# EAGLE design T03-GSM-Schematic (EAGLE 7.6.0)
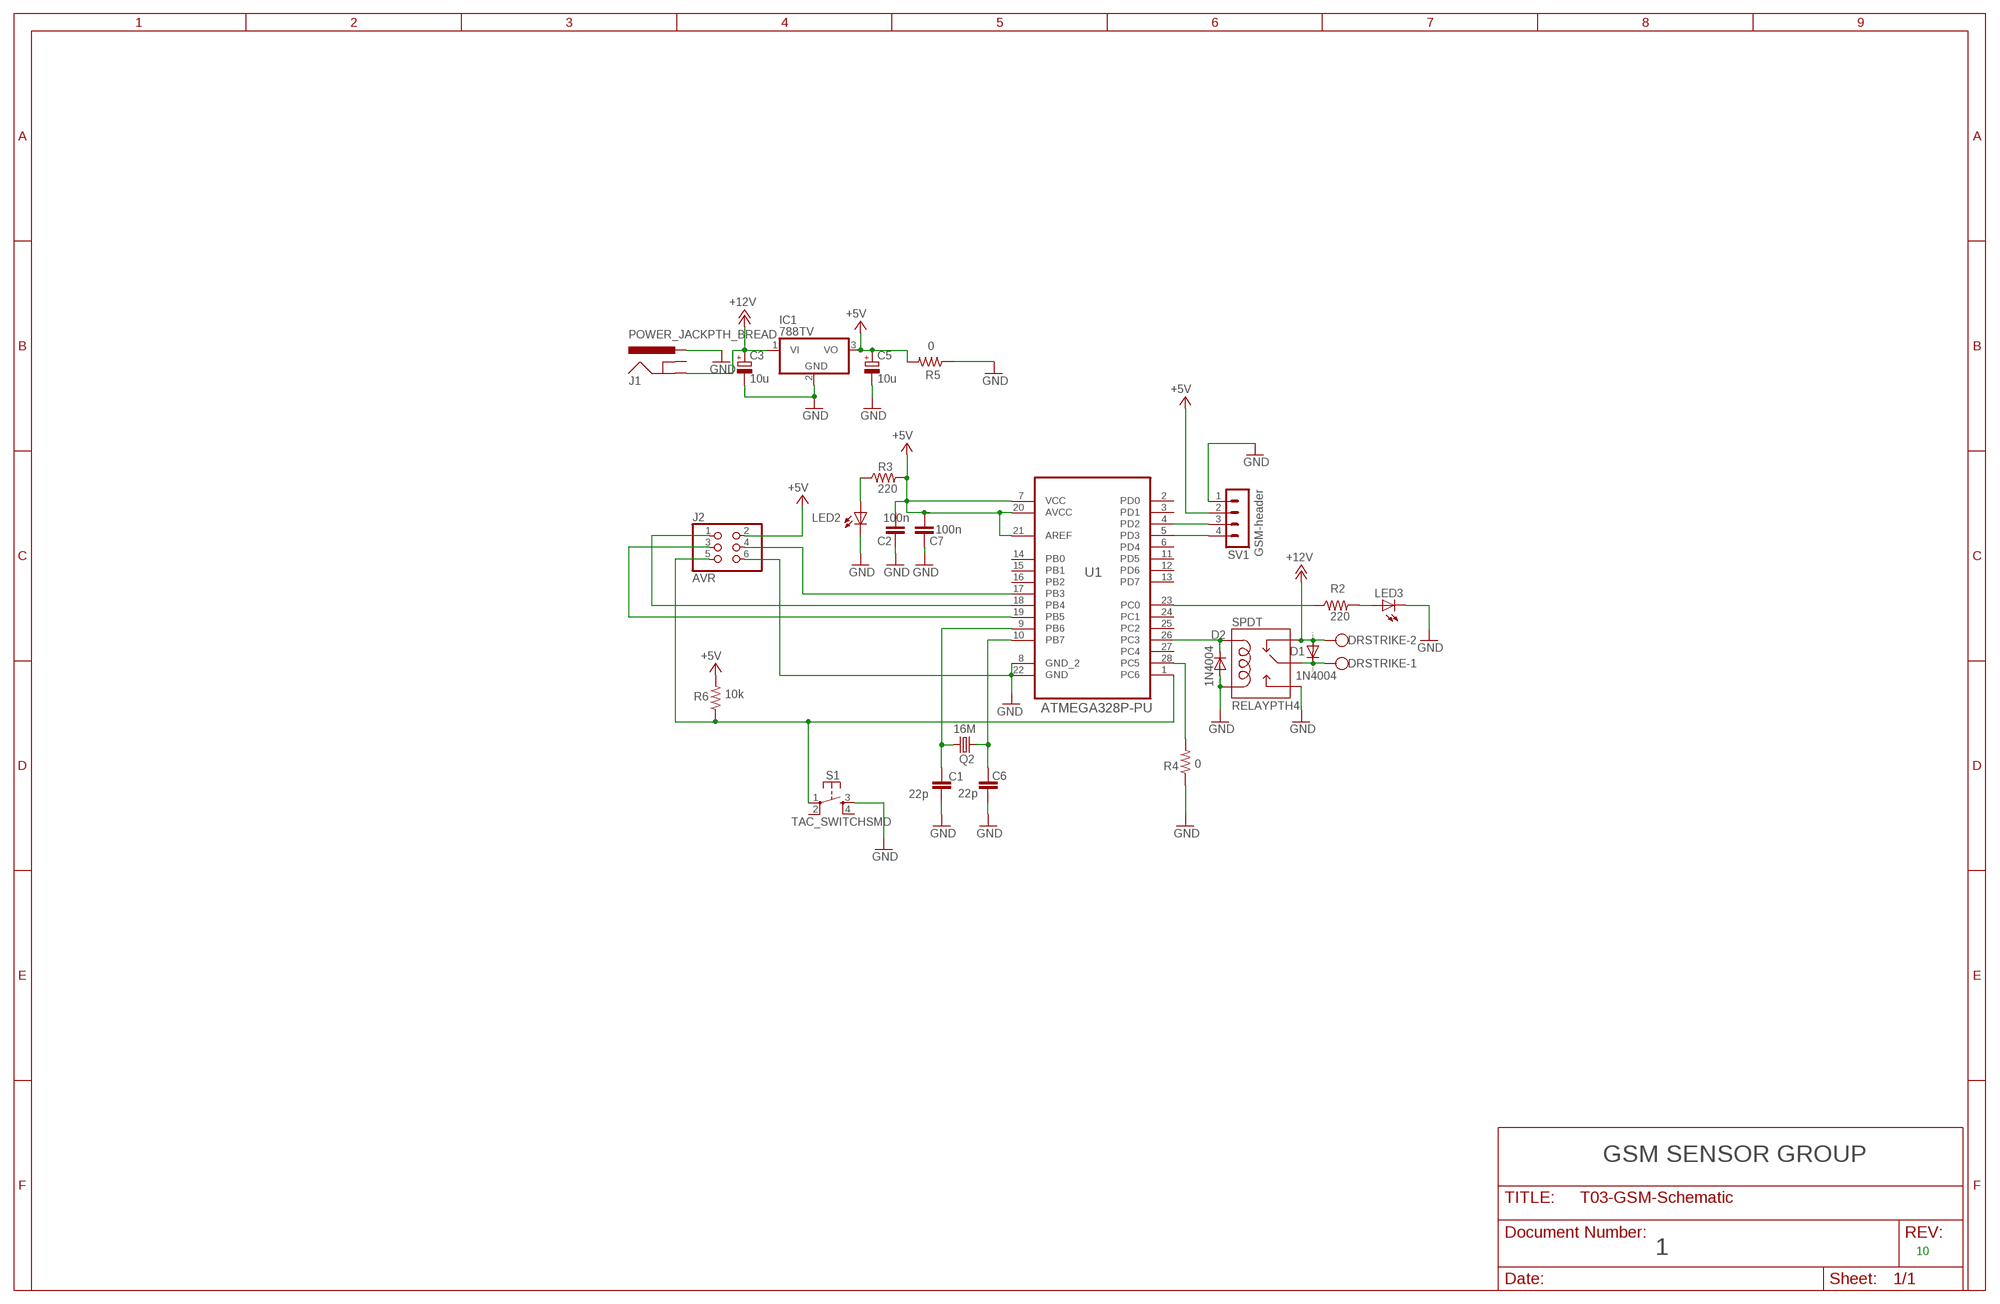
[diagram p0: schematic, sheet 1]

## Parts
C1  22p  C-EUC0603  [C0603]
C2  100n  C-EUC0603  [C0603]
C3  10u  CPOL-EUE5-10.5  [E5-10,5]
C5  10u  CPOL-EUE5-10.5  [E5-10,5]
C6  22p  C-EUC0603  [C0603]
C7  100n  C-EUC0603  [C0603]
D1  1N4004  [DO41-10]
D2  1N4004  [DO41-10]
DRSTRIKE  W237-102  [W237-102]
IC1  788TV  [TO220V]
J1  POWER_JACKPTH_BREAD  [POWER_JACK_PTH_BREAD]
J2  AVR  PINHD-2X3  [2X03]
LED2  LEDSML0603  [SML0603]
LED3  LED5MM  [LED5MM]
Q2  16M  CRYSTALHC49UP  [HC49UP]
R2  220  R-US_R0603  [R0603]
R3  220  R-US_R0603  [R0603]
R4  0  R-US_0204/5  [0204/5]
R5  0  R-US_0204/5  [0204/5]
R6  10k  R-US_R0603  [R0603]
S1  TAC_SWITCHSMD  [TACTILE-SWITCH-SMD]
SPDT  RELAYPTH4  [RELAY-JZC]
SV1  GSM-header  MA04-1  [MA04-1]
U1  ATMEGA328P-PU  [DIP254P762X457-28]

## Nets
+5V: C2.2 C5.+ C7.2 IC1.3(VO) J2.2 R3.2 R5.2 R6.2 SV1.2 U1.7(VCC) U1.20(AVCC) U1.21(AREF)
+12V: C3.+ D1.A DRSTRIKE.2 IC1.1(VI) J1.GND SPDT.2(NC)
GND: C1.2 C2.1 C3.- C5.- C6.2 C7.1 D2.A IC1.2(GND) J1.PWR J2.6 LED2.C LED3.K(C) R4.1 R5.1 S1.3 SPDT.1(COIL2) SPDT.3(NO) SV1.1 U1.8(GND_2) U1.22(GND)
N$2: J2.5 R6.1 S1.1 U1.1(PC6)
N$3: LED2.A R3.1
N$4: D1.C DRSTRIKE.1 SPDT.4(MAIN)
N$5: J2.3 U1.19(PB5)
N$6: LED3.A R2.2
N$7: J2.4 U1.17(PB3)
N$8: J2.1 U1.18(PB4)
N$9: R2.1 U1.23(PC0)
N$12: R4.2 U1.28(PC5)
N$14: D2.C SPDT.5(COIL1) U1.26(PC3)
N$16: C1.1 Q2.2 U1.9(PB6)
N$18: C6.1 Q2.1 U1.10(PB7)
RX: SV1.4 U1.5(PD3)
TX: SV1.3 U1.4(PD2)
Unconnected: J1.GNDBREAK S1.2 S1.4 U1.2(PD0) U1.3(PD1) U1.6(PD4) U1.11(PD5) U1.12(PD6) U1.13(PD7) U1.14(PB0) U1.15(PB1) U1.16(PB2) U1.24(PC1) U1.25(PC2) U1.27(PC4)

## Notes on the sheet
- GSM SENSOR GROUP
- 1 | 10

## Library data of the parts
C1 C2 C6 C7 = rcl:C-EU: CAPACITOR, European symbol
C3 C5 = rcl:CPOL-EU: POLARIZED CAPACITOR, European symbol
D1 D2 = diode:1N4004: DIODE general purpose rectifier, 1 A
DRSTRIKE = con-wago-500:W237-102: WAGO SCREW CLAMP; MPN: 237-102; OC_FARNELL: unknown; OC_NEWARK: 70K9898
IC1 = linear:78*: Positive VOLTAGE REGULATOR Source: http://cache.national.com/ds/LM/LM78L05.pdf http://www.fairchildsemi.com/ds/LM/LM7805.pdf
J1 = SparkFun-Connectors:POWER_JACK: Power Jack This is the standard 5.5mm barrel jack for power. The PTH is the most common, proven, reliable, footprint. The Slot footprint only works if the mill layer is transmitted to the PCB fab house so be warned. Mating wall wart : TOL-00298 (and others); PROD_ID: PRT-10811
J2 = pinhead:PINHD-2X3: PIN HEADER
LED2 LED3 = led:LED: LED OSRAM: - CHIPLED LG R971, LG N971, LY N971, LG Q971, LY Q971, LO R971, LY R971 LH N974, LH R974 LS Q976, LO Q976, LY Q976 LO Q996 - Hyper CHIPLED LW Q18S LB Q993, LB Q99A, LB R99A - SideLED LS A670, LO A670, LY A670, LG A670, LP A670 LB A673, LV A673, LT A673, LW A673 LH A674 LY A675 LS A676, LA A676, LO A676, LY A676, LW A676 LS A679, LY A679, LG A679 - Hyper Micro SIDELED® LS Y876, LA Y876, LO Y876, LY Y876 LT Y87S - SmartLED LW L88C, LW L88S LB L89C, LB L89S, LG L890 LS L89K, LO L89K, LY L89K LS L896, LA L896, LO L896, LY L896 - TOPLED LS T670, LO T670, LY T670, LG T670, LP T670 LSG T670, LSP T670, LSY T670, LOP T670, LYG T670 LG T671, LOG T671, LSG T671 LB T673, LV T673, LT T673, LW T673 LH T674 LS T676, LA T676, LO T676, LY T676, LB T676, LH T676, LSB T676, LW T676 LB T67C, LV T67C, LT T67C, LS T67K, LO T67K, LY T67K, LW E67C LS E67B, LA E67B, LO E67B, LY E67B, LB E67C, LV E67C, LT E67C LW T67C LS T679, LY T679, LG T679 LS T770, LO T770, LY T770, LG T770, LP T770 LB T773, LV T773, LT T773, LW T773 LH T774 LS E675, LA E675, LY E675, LS T675 LS T776, LA T776, LO T776, LY T776, LB T776 LHGB T686 LT T68C, LB T68C - Hyper Mini TOPLED® LB M676 - Mini TOPLED Santana® LG M470 LS M47K, LO M47K, LY M47K Source: http://www.osram.convergy.de LUXEON: - LUMILED® LXK2-PW12-R00, LXK2-PW12-S00, LXK2-PW14-U00, LXK2-PW14-V00 LXK2-PM12-R00, LXK2-PM12-S00, LXK2-PM14-U00 LXK2-PE12-Q00, LXK2-PE12-R00, LXK2-PE12-S00, LXK2-PE14-T00, LXK2-PE14-U00 LXK2-PB12-K00, LXK2-PB12-L00, LXK2-PB12-M00, LXK2-PB14-N00, LXK2-PB14-P00, LXK2-PB14-Q00 LXK2-PR12-L00, LXK2-PR12-M00, LXK2-PR14-Q00, LXK2-PR14-R00 LXK2-PD12-Q00, LXK2-PD12-R00, LXK2-PD12-S00 LXK2-PH12-R00, LXK2-PH12-S00 LXK2-PL12-P00, LXK2-PL12-Q00, LXK2-PL12-R00 Source: www.luxeon.com KINGBRIGHT: KA-3528ASYC Source: www.kingbright.com
Q2 = crystal:CRYSTAL: CRYSTAL; OC_FARNELL: unknown; OC_NEWARK: unknown
R2-R6 = rcl:R-US_: RESISTOR, American symbol
S1 = SparkFun-Retired:TAC_SWITCH: Momentary Switch Button commonly used for reset or general input. Spark Fun Electronics SKU : COM-00097 SMT- SWCH-08247; PROD_ID: SWCH-08247
SPDT = SparkFun-Electromechanical:RELAY: SPDT relay (COM-00101)
SV1 = con-lstb:MA04-1: PIN HEADER; OC_FARNELL: unknown; OC_NEWARK: unknown
U1 = Atmel_By_element14_Batch_1-00:ATMEGA328P-PU: 8-bit Microcontroller with In-System Programmable Flash; MPN: ATMEGA328P-PU; OC_FARNELL: 1715487; OC_NEWARK: 15R0268; PACKAGE: PDIP-28; SUPPLIER: Atmel

## Board
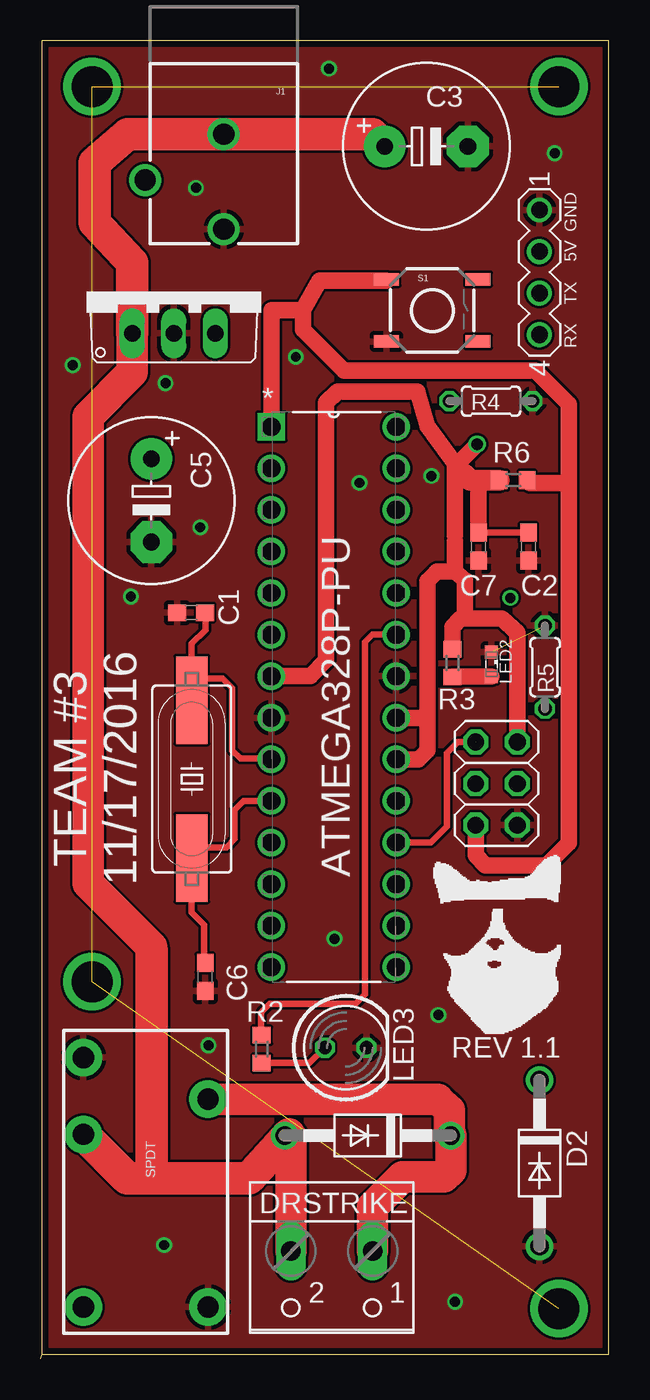
[diagram p1: board, top side]
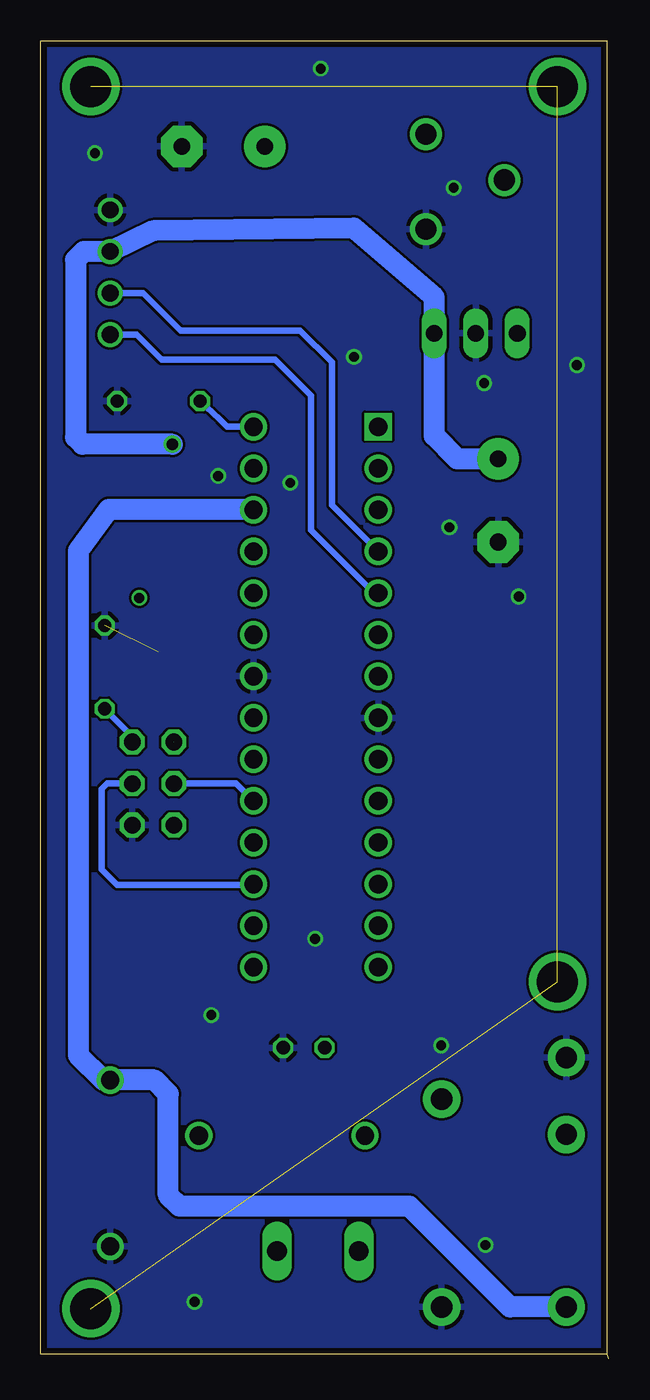
[diagram p2: board, bottom side, seen from below]

Size 34.71 x 80.51 mm. Coordinates in mm from the lower left corner, seen from the top.
Outline: 0,0 0.08,0.25
Outline: 0.08,0.25 34.71,0.25 34.71,80.51 0.08,80.51 0.08,0.25
Copper layers (1*16): Top 0.0356mm / dielectric 1.5011mm / Bottom 0.0356mm
Design rules "oshpark-2layer": minimum track width 6mil, minimum drill 13mil, track to track 6mil, track to pad 6mil, pad to pad 6mil, via to via 6mil, smd to smd 6mil, copper to edge 15mil, drill to drill 6mil, minimum pad ring 7mil, minimum via ring 7mil, stop-mask expansion 2.5mil, vias tented up to drill 0mil, thermal gap 10mil

### Footprints (pad centres in the part's own frame; a part is rotated, then mirrored left to right if it is on the bottom)
C0603 = smd 1.1 x 1: 1 -0.85,0; 2 0.85,0
E5-10,5 = drill 1.016 pad 2.54: + -2.54,0 | drill 1.016 pad 2.54 octagon: - 2.54,0
DO41-10 = drill 1.118: A 5.08,0; C -5.08,0
W237-102 = drill 1.194 long: 1 -2.5,-1.27; 2 2.5,-1.27
TO220V = drill 1.016 long: 1 -2.54,-2.54; 2 0,-2.54; 3 2.54,-2.54
POWER_JACK_PTH_BREAD = drill 1.3: GND 0,7.9; GNDBREAK 4.8,10.7; PWR 0,13.7
2X03 = drill 1.016 octagon: 1 -2.54,-1.27; 2 -2.54,1.27; 3 0,-1.27; 4 0,1.27; 5 2.54,-1.27; 6 2.54,1.27
SML0603 = smd 0.8 x 0.8: A 0.75,0; C -0.75,0
LED5MM = drill 0.813 octagon: A -1.27,0; K 1.27,0
HC49UP = smd 5.334 x 1.93: 1 -4.826,0; 2 4.826,0
R0603 = smd 1 x 1.1: 1 -0.85,0; 2 0.85,0
0204/5 = drill 0.813 octagon: 1 -2.54,0; 2 2.54,0
TACTILE-SWITCH-SMD = smd 1.524 x 0.762: 1 -2.794,1.905; 2 2.794,1.905; 3 -2.794,-1.905; 4 2.794,-1.905
RELAY-JZC = drill 1.3 pad 2.286: 1 3.81,-8.89; 2 -3.81,1.651; 3 -3.81,6.35; 4 3.81,3.81; 5 -3.81,-8.89
MA04-1 = drill 1.016: 1 -3.81,0; 2 -1.27,0; 3 1.27,0; 4 3.81,0
DIP254P762X457-28 = drill 1.118 square: 1 -7.62,33.02 | drill 1.118: 2 -7.62,30.48; 3 -7.62,27.94; 4 -7.62,25.4; 5 -7.62,22.86; 6 -7.62,20.32; 7 -7.62,17.78; 8 -7.62,15.24; 9 -7.62,12.7; 10 -7.62,10.16; 11 -7.62,7.62; 12 -7.62,5.08; 13 -7.62,2.54; 14 -7.62,0; 15 0,0; 16 0,2.54; 17 0,5.08; 18 0,7.62; 19 0,10.16; 20 0,12.7; 21 0,15.24; 22 0,17.78; 23 0,20.32; 24 0,22.86; 25 0,25.4; 26 0,27.94; 27 0,30.48; 28 0,33.02

### Placement (x,y rotation side)
C1  9.19,45.58 180 top
C2  29.8,49.61 90 top
C3  23.56,74.07 0 top
C5  6.75,52.43 270 top
C6  10.04,23.32 270 top
C7  26.75,49.61 90 top
D1  19.98,13.63 180 top
D2  30.48,11.94 270 top
DRSTRIKE  17.77,5.3 180 top
IC1  8.13,65.19 0 top
J1  11.17,82.71 180 top
J2  27.85,35.13 270 top
LED2  27.55,42.43 270 top
LED3  18.63,18.99 0 top
Q2  9.22,35.41 90 top
R2  13.49,18.91 270 top
R3  25.15,42.49 90 top
R4  27.51,58.5 180 top
R5  30.82,42.24 270 top
R6  28.87,53.67 180 top
S1  23.92,64.04 0 top
SPDT  6.4,12.04 0 top
SV1  30.48,66.37 270 top
U1  21.71,23.91 0 top

### Tracks (layer width: path | path; a pad name or v marks a point on that pad's centre or on a via)
+5V  (via drill 0.7)
  Top 0.406: 25.91,45.55 25.65,45.21 | R3.2 | 25.91,46.47 25.91,46.56 | 24.12,48 arc-90 24.21,48.09 | 25.82,54.09 arc90 25.82,54.1 | 25.31,49.95 25.31,50.29 25.31,50.2 | 24.47,55.79 25.31,54.69 25.48,54.69 | C2.2 C7.2 | C7.2 | 23.03,59.09
  Top 1.016: 25.91,46.56 25.91,45.55 | R3.2 25.14,44.7 25.65,45.21 28.19,45.21 29.12,44.36 J2.2 | U1.7 16.47,41.69 17.44,42.67 17.44,58.41 18.12,59.09 23.03,59.09 23.62,56.97 25.31,54.69 | 24.12,48 23.62,47.49 23.62,39.03 | 23.62,39.03 23.62,37.16 23.07,36.61 U1.20 | U1.21 23.49,39.15 23.62,39.03 | 24.21,48.09 25.31,48.09 | 25.91,46.47 25.91,47.58 25.31,48.09 | 25.31,49.95 25.31,48.09 | 25.31,54.69 25.82,54.1 | R6.2 26.75,53.67 C7.2 | 25.31,50.29 25.31,50.54 25.31,54.69 | 25.48,54.69 v26.67,55.87
  Top 1.27: 25.82,54.09 26.24,53.67 R6.2
  Bottom 0.406: IC1.3 | J2.2 29.12,38.01 R5.2
  Bottom 1.27: v26.67,55.87 32.17,55.87 32.59,56.3 32.59,67.13 32.09,67.64 SV1.2 27.85,68.91 15.58,69.08 10.67,64.85 IC1.3 10.67,56.38 9.25,54.97 C5.+
+12V
  Top 0.406: 15.27,13.59 D1.A 15.17,13.69 | 6.77,25.14 6.77,24.97
  Top 1.93: DRSTRIKE.2 15.27,13.59 | 6.77,25.14 2.88,29.04 2.88,57.57 5.59,60.28 IC1.1 | 6.86,11.01 6.77,11.01 | IC1.1
  Top 2: 15.17,13.69 12.74,11.01 6.86,11.01 6.77,11.09 6.77,24.97 | SPDT.2 5.28,11.01 6.77,11.01 | C3.+ 20.28,74.81 J1.GND 5.31,74.81 3.3,73.06 3.3,69.42 5.59,66.96 IC1.1
GND  (via drill 0.6)  (1 unrouted)
  other vias: 19.47,53.5 9.74,50.79 9.48,71.54 23.87,53.93 17.95,25.65 5.5,46.56 31.41,73.65 15.58,61.21 1.95,60.7 24.3,21 7.62,59.6 7.53,6.94 17.61,78.82 25.31,3.47 10.24,19.13
  pour Top: 0.08,80.51 34.73,80.51 34.73,0.25 0.08,0.25
  pour Bottom: 0.08,80.51 0.08,0.25 34.73,0.25 34.73,80.51
MHOLES  (via drill 2.5)  (3 unrouted)
  other vias: 31.66,77.72 31.66,3.05 3.13,23.03 3.13,77.72
N$1  (via drill 0.6)
  other vias: 28.7,46.48
N$2
  Top 0.406: 21.08,65.99 S1.1 21.13,65.86 | 16,64.07 16.02,64.09 | R6.1 29.89,53.5
  Top 1.016: U1.1 14.09,64.07 16,64.07 | 32.25,53.5 32.25,58.33 30.22,60.36 18.54,60.36 16.02,62.88 16.02,64.09 17.02,65.86 21.13,65.86 | 32.25,53.5 32.25,47.07 32.25,46.31 32.25,31.49 30.9,30.14 27.18,30.14 26.58,30.73 J2.5 | 29.89,53.5 32.25,53.5
N$3
  Top 0.406: R3.1 25.19,41.68
  Top 1.016: 25.19,41.68 LED2.A
N$4
  Top 0.406: 24.97,13.71 D1.C
  Top 1.93: DRSTRIKE.1 20.27,9.27 22.1,11.09 24.64,11.09 25.06,11.51 D1.C | SPDT.4 24.27,15.85 24.97,15.15 24.97,13.71
N$5
  Bottom 0.406: U1.19 22.77,35.13 J2.3
N$6
  Top 0.406: R2.2 16.43,18.06 LED3.A
N$7
  Bottom 0.406: J2.4 30.65,35.13 30.98,34.79 30.98,29.88 30.05,28.95 21.75,28.95 U1.17
N$8  (1 unrouted)
  Top 0.406: U1.18 23.83,31.53 24.8,32.51 24.8,37 25.48,37.67 J2.1
N$9
  Top 0.406: R2.1 13.46,19.76 13.46,21.16 13.97,21.67 19.22,21.67 19.81,22.26 19.81,42.33 | 19.81,42.33 | 19.81,42.33 19.81,43.77 20.28,44.23 U1.23
N$12
  Bottom 0.406: U1.28 23.32,56.93 23.79,57.4 R4.2
N$14
  Bottom 0.406: 21.75,51.9 U1.26 | D2.C 30.9,17.02
  Bottom 1.27: SPDT.5 6.03,3.15 12.19,9.31 26.24,9.31 26.92,9.99 26.92,16.17 27.77,17.02 D2.C | 21.75,51.9 30.56,51.9 32.42,49.36 32.42,18.54 30.9,17.02
N$16
  Top 0.406: C1.1 10.07,45.54 10.07,44.53 9.22,43.68 9.22,41.57 | 9.22,41.57 Q2.2 | U1.9 14.05,36.66 12.19,36.66 11.68,37.16 11.68,40.97 11.09,41.57 9.22,41.57
N$18
  Top 0.406: C6.1 9.99,24.54 9.99,26.5 9.22,27.26 Q2.1 9.88,31.24 11.34,31.24 11.85,31.75 11.85,33.52 12.4,34.07 U1.10
RX
  Bottom 0.406: U1.5 14.35,46.77 18.2,50.63 18.2,58.84 20.4,61.04 27.34,61.04 28.87,62.56 | SV1.4 28.87,62.56 | 28.87,62.56
TX
  Bottom 0.406: U1.4 16.93,52.15 16.93,60.87 18.88,62.82 26.16,62.82 28.44,65.1 SV1.3 | SV1.3

### Text on the board
tPlace: GND | 5V | TX | RX | TEAM #3 / 11/17/2016 | REV 1.1